# Altium schematic sheet SD.SchDoc
size A4
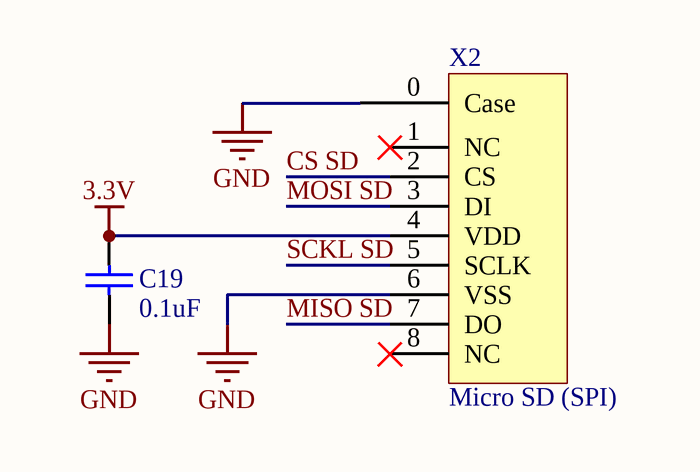
[diagram p0: SD.SchDoc]

## Parts
C19  value 0.1uF  [C0603]  (hidden comment: CAP CER 0603 0.1uF 50V C0G 10%)
X2  Micro SD (SPI)  [475710001]

## Nets
3.3V: C19.2 X2.4(VDD)
GND: C19.1 X2.0(Case) X2.6(VSS)
CS SD: X2.2(CS)
MISO SD: X2.7(DO)
MOSI SD: X2.3(DI)
SCKL SD: X2.5(SCLK)

Not connected (* = marked no-connect by the designer): X2 1(NC)* 8(NC)*

## Library data of the parts
C19 = CAP CER 0603 0.1uF 50V C0G 10%: 0.1uF ceramic capacitor; Manufacturer: TDK Corporation; Part_Number: CGA3E2X7R1H104K080AA; Supplier_Link: http://www.digikey.ca/product-detail/en/CGA3E2X7R1H104K080AA/445-5666-1-ND/2443706; Tolerance: 10%; Voltage rating: 50V; Price: 0.14; Supplier 1: Digi-Key; Supplier Part Number 1: 445-5666-1-ND; Price_10: 0.102
X2 = 475710001: microSD connector, Surface Mount, Right Angle; Manufacturer: Molex; Part_Number: 47571-0001; Price: 1.39; Price_10: 1.227; Supplier_Link: http://www.digikey.ca/product-search/en/connectors-interconnects/memory-connectors-pc-card-sockets/1442985?k=475710001&k=&pkeyword=475710001&pv7=2&FV=fff40016%2Cfff804a9&mnonly=0&newproducts=0&ColumnSort=0&page=1&stock=1&quantity=0&ptm=0&fid=0&pageSize=25